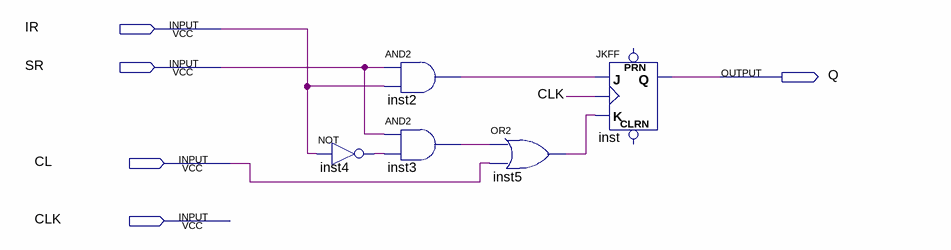
[diagram p0: schematic sheet]
// Quartus schematic REG1_SR_CL.bdf as structural Verilog: 5 symbols, 5 pins
module REG1_SR_CL (
  input  IR,
  input  SR,
  input  CL,
  input  CLK,
  output Q
);

  wire inst2_out, inst3_out, inst4_out, inst5_out;

  not inst4 (inst4_out, IR);
  and inst2 (inst2_out, SR, IR);
  and inst3 (inst3_out, SR, inst4_out);
  or inst5 (inst5_out, inst3_out, CL);
  JKFF inst (.K(inst5_out), .J(inst2_out), .CLK(CLK), .Q(Q));  // open: PRN, CLRN
endmodule
